# Altium schematic sheet PSU.SchDoc
size A4; SheetNumber: 1
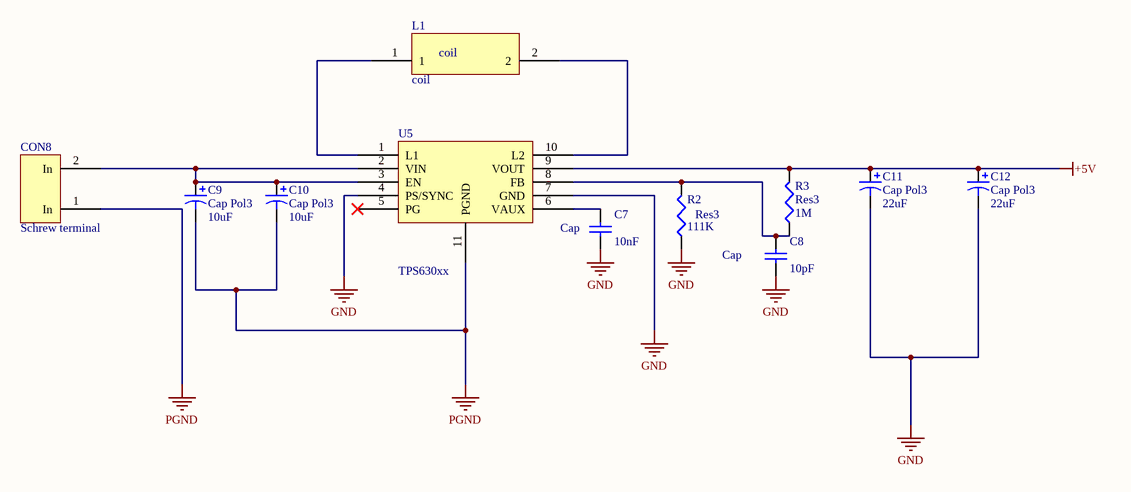
[diagram p0: PSU.SchDoc]

## Parts
C7  Cap  value 10nF  [0402]
C8  Cap  value 10pF  [0402]
C9  Cap Pol3  value 10uF  [C0805]
C10  Cap Pol3  value 10uF  [C0805]
C11  Cap Pol3  value 22uF  [C0805]
C12  Cap Pol3  value 22uF  [C0805]
CON8  Schrew terminal  [ScrewTerminal]
L1  coil  [Coil]
R2  Res3  value 111K  [J1-0603]
R3  Res3  value 1M  [J1-0603]
U5  TPS630xx  [TPS63061]

## Nets
+5V: C11.1 C12.1 R3.2 U5.9(VOUT)
GND: C7.1 C8.1 C11.2 C12.2 R2.1 U5.4(PS/SYNC) U5.7(GND)
PGND: C9.2 C10.2 CON8.1(In) U5.11(PGND)
NetC7_2: C7.2 U5.6(VAUX)
NetC8_2: C8.2 R2.2 R3.1 U5.8(FB)
NetC9_1: C9.1 C10.1 CON8.2(In) U5.2(VIN) U5.3(EN)
NetL1_1: L1.1 U5.1(L1)
NetL1_2: L1.2 U5.10(L2)

Not connected (* = marked no-connect by the designer): U5 5(PG)*

## Library data of the parts
C7 C8 = Cap Semi: Capacitor (Semiconductor SIM Model); Published: 8-Jun-2000; LatestRevisionDate: 29-May-2009; LatestRevisionNote: IPC-7351 Footprint Added.; PackageReference: C1206; Publisher: Altium Limited; PackageDescription: Chip Capacitor
C9-C12 = Cap Pol3: Polarized Capacitor (Surface Mount); Published: 8-Jun-2000; LatestRevisionDate: 29-May-2009; LatestRevisionNote: IPC-7351 Footprint Added.; PackageReference: C0805; Publisher: Altium Limited; PackageDescription: Chip Capacitor
R2 R3 = Res3: Resistor; Published: 8-Jun-2000; LatestRevisionDate: 29-May-2009; LatestRevisionNote: IPC-7351 Footprint Added.; PackageReference: J1-0603; Publisher: Altium Limited; PackageDescription: Chip Resistor